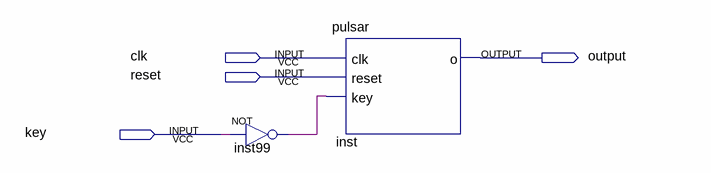
[diagram p0: schematic sheet]
// Quartus schematic YL_pulsar.bdf as structural Verilog: 2 symbols, 4 pins
module YL_pulsar (
  input  clk,
  input  reset,
  input  key,
  output \output 
);

  wire inst99_out;

  not inst99 (inst99_out, key);
  pulsar inst (.clk(clk), .reset(reset), .key(inst99_out), .o(\output ));
endmodule
